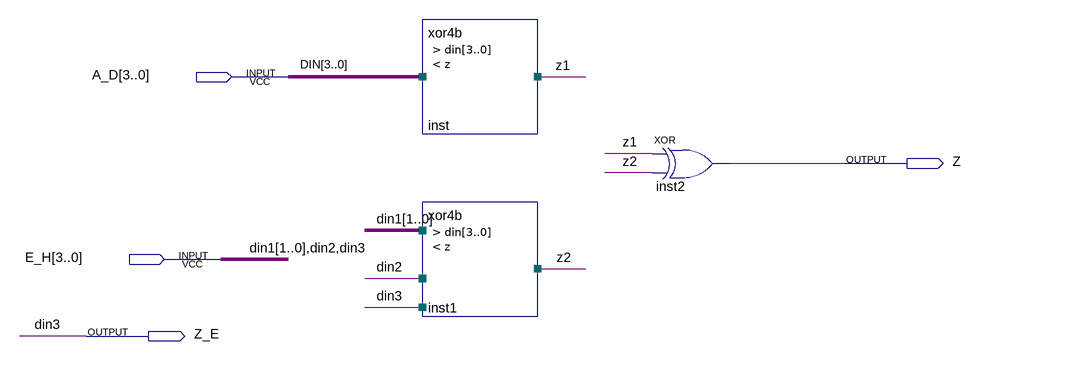
[diagram p0: schematic sheet]
// Quartus schematic xor8b.bdf as structural Verilog: 3 symbols, 4 pins
module xor8b (
  input  [3:0] A_D,
  input  [3:0] E_H,
  output Z,
  output Z_E
);

  wire z1, z2;

  xor4b inst (.din(A_D), .z(z1));
  xor4b inst1 (.z(z2));  // open: din
  xor inst2 (Z, z1, z2);

  assign Z_E = E_H[0];

  // Other names for the same wires on the sheet: DIN[3:0] = A_D; din1[1:0] = E_H[3:2]; din2 = E_H[1]; din3 = E_H[0]
endmodule
